# EAGLE design light_triggger_attiny44_(2) (EAGLE 6.4)
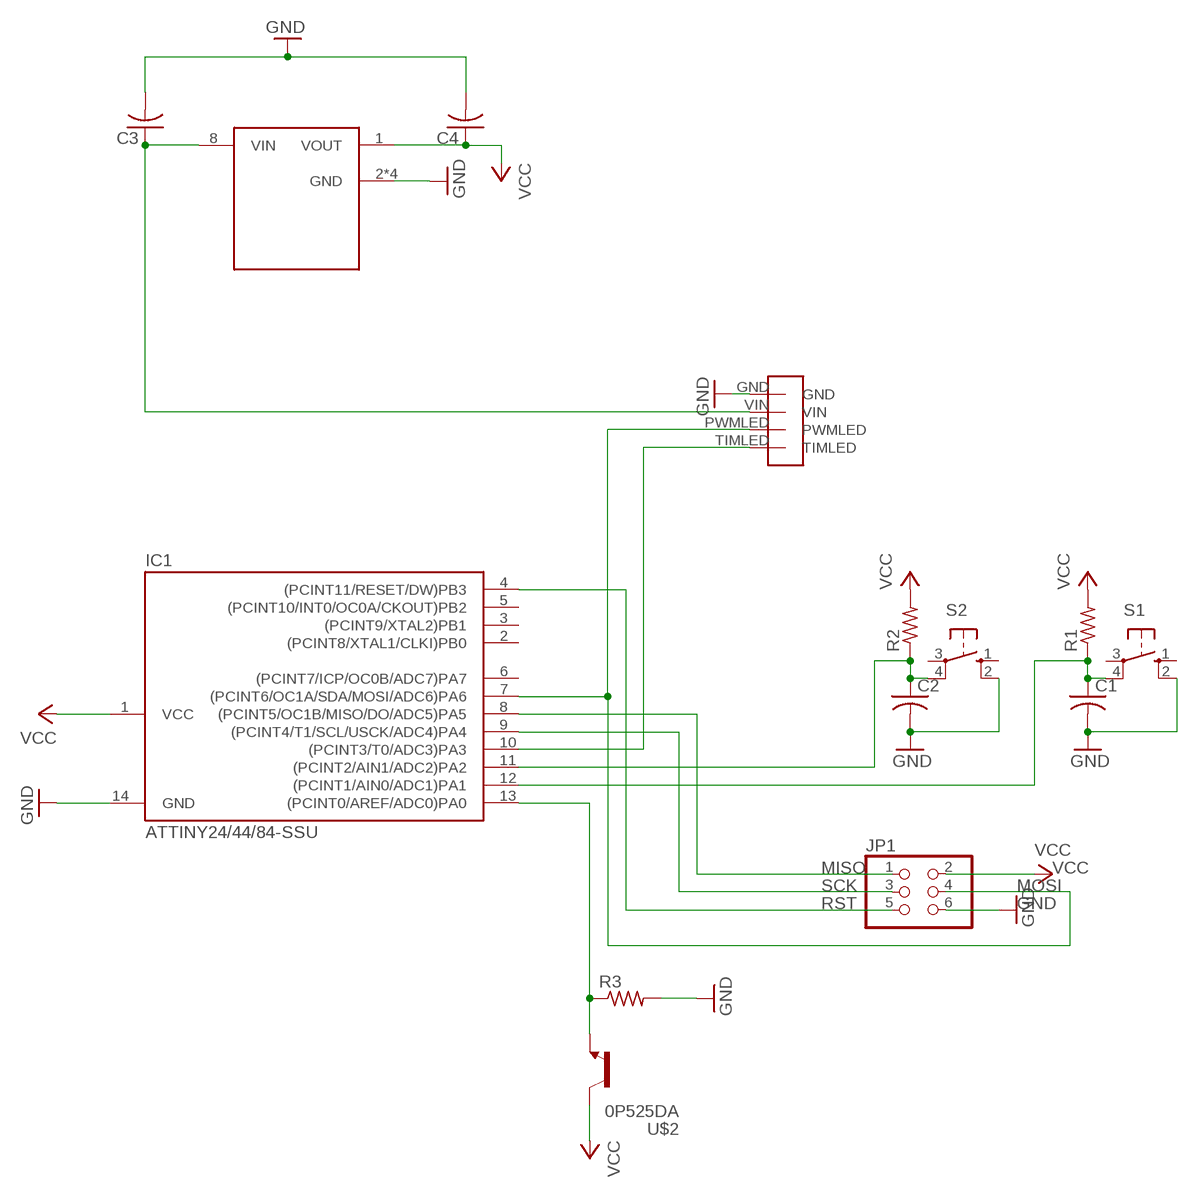
[diagram p0: schematic, sheet 1]

## Parts
C1  C-USC0603K  [C0603K]
C2  C-USC0603K  [C0603K]
C3  C-USC0603K  [C0603K]
C4  C-USC0603K  [C0603K]
IC1  ATTINY24/44/84-SSU  [SOIC14]
JP1  PINHD-2X3  [2X03]
R1  R-US_R0603  [R0603]
R2  R-US_R0603  [R0603]
R3  R-US_R0603  [R0603]
S1  10-XX  [B3F-10XX]
S2  10-XX  [B3F-10XX]
U$1  LM78L05  [LM78L05]
U$2  0P525DA  [PHOTOTRANSITOR(OP525DA)]
U$3  SM04B-GHS-TB  [SM04B-GHS-TB]

## Nets
GND: C1.2 C2.2 C3.2 C4.2 IC1.14(GND) JP1.6 R3.2 S1.2(S1) S2.2(S1) U$1.2(GND) U$1.3(GND) U$1.6(GND) U$1.7(GND) U$3.GND
MISO: IC1.8((PCINT5/OC1B/MISO/DO/ADC5)PA5) JP1.1
MOSI: IC1.7((PCINT6/OC1A/SDA/MOSI/ADC6)PA6) JP1.4 U$3.PWMLED
N$1: IC1.13((PCINT0/AREF/ADC0)PA0) R3.1 U$2.P$2(E)
N$2: IC1.10((PCINT3/T0/ADC3)PA3) U$3.TIMLED
N$3: C1.1 IC1.12((PCINT1/AIN0/ADC1)PA1) R1.1 S1.4(P1)
N$5: C2.1 IC1.11((PCINT2/AIN1/ADC2)PA2) R2.1 S2.4(P1)
RST: IC1.4((PCINT11/RESET/DW)PB3) JP1.5
SCK: IC1.9((PCINT4/T1/SCL/USCK/ADC4)PA4) JP1.3
VCC: C4.1 IC1.1(VCC) JP1.2 R1.2 R2.2 U$1.1(VOUT) U$2.P$1(C)
VIN: C3.1 U$1.8(VIN) U$3.VIN
Unconnected: IC1.2((PCINT8/XTAL1/CLKI)PB0) IC1.3((PCINT9/XTAL2)PB1) IC1.5((PCINT10/INT0/OC0A/CKOUT)PB2) IC1.6((PCINT7/ICP/OC0B/ADC7)PA7) S1.1(S) S1.3(P) S2.1(S) S2.3(P)

## Library data of the parts
C1-C4 = resistor:C-US: CAPACITOR, American symbol
IC1 = attiny24_44_84:ATTINY24/44/84
JP1 = pinhead:PINHD-2X3: PIN HEADER
R1-R3 = resistor:R-US_: RESISTOR, American symbol
S1 S2 = switch-omron:10-XX: OMRON SWITCH; MPN: B3F-1000; OC_FARNELL: 176432; OC_NEWARK: 36M3542
U$1 = LM78L05:LM78L05
U$2 = OPTEK:0P525DA
U$3 = Wire-to-Board:SM04B-GHS-TB

## Board
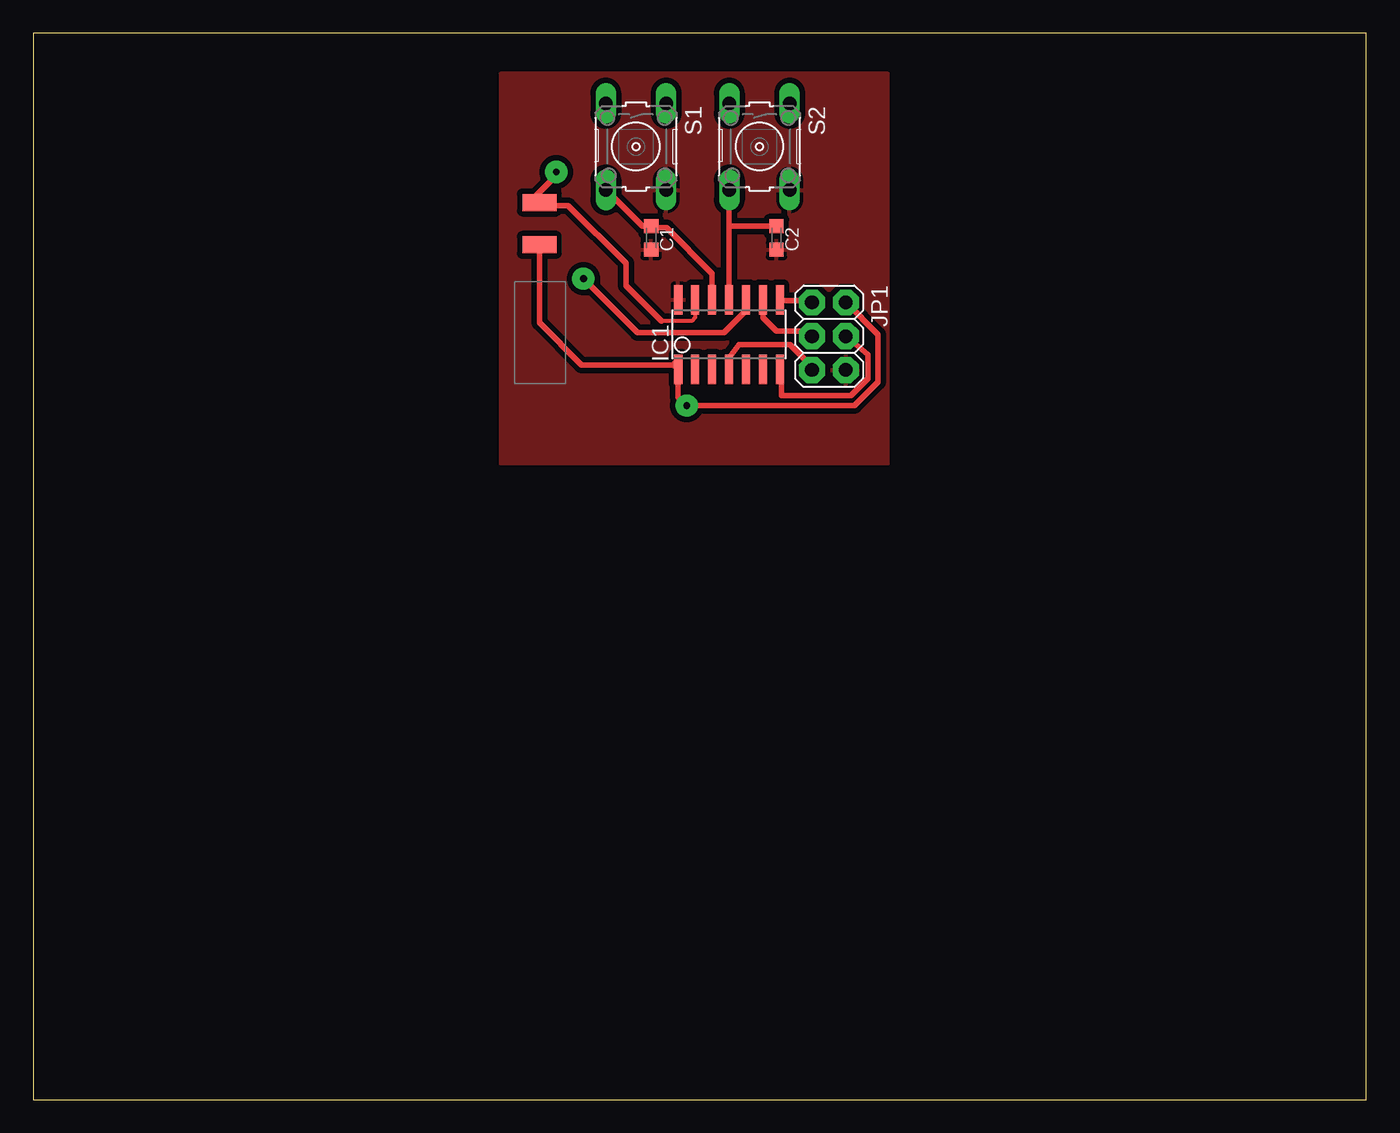
[diagram p1: board, top side]
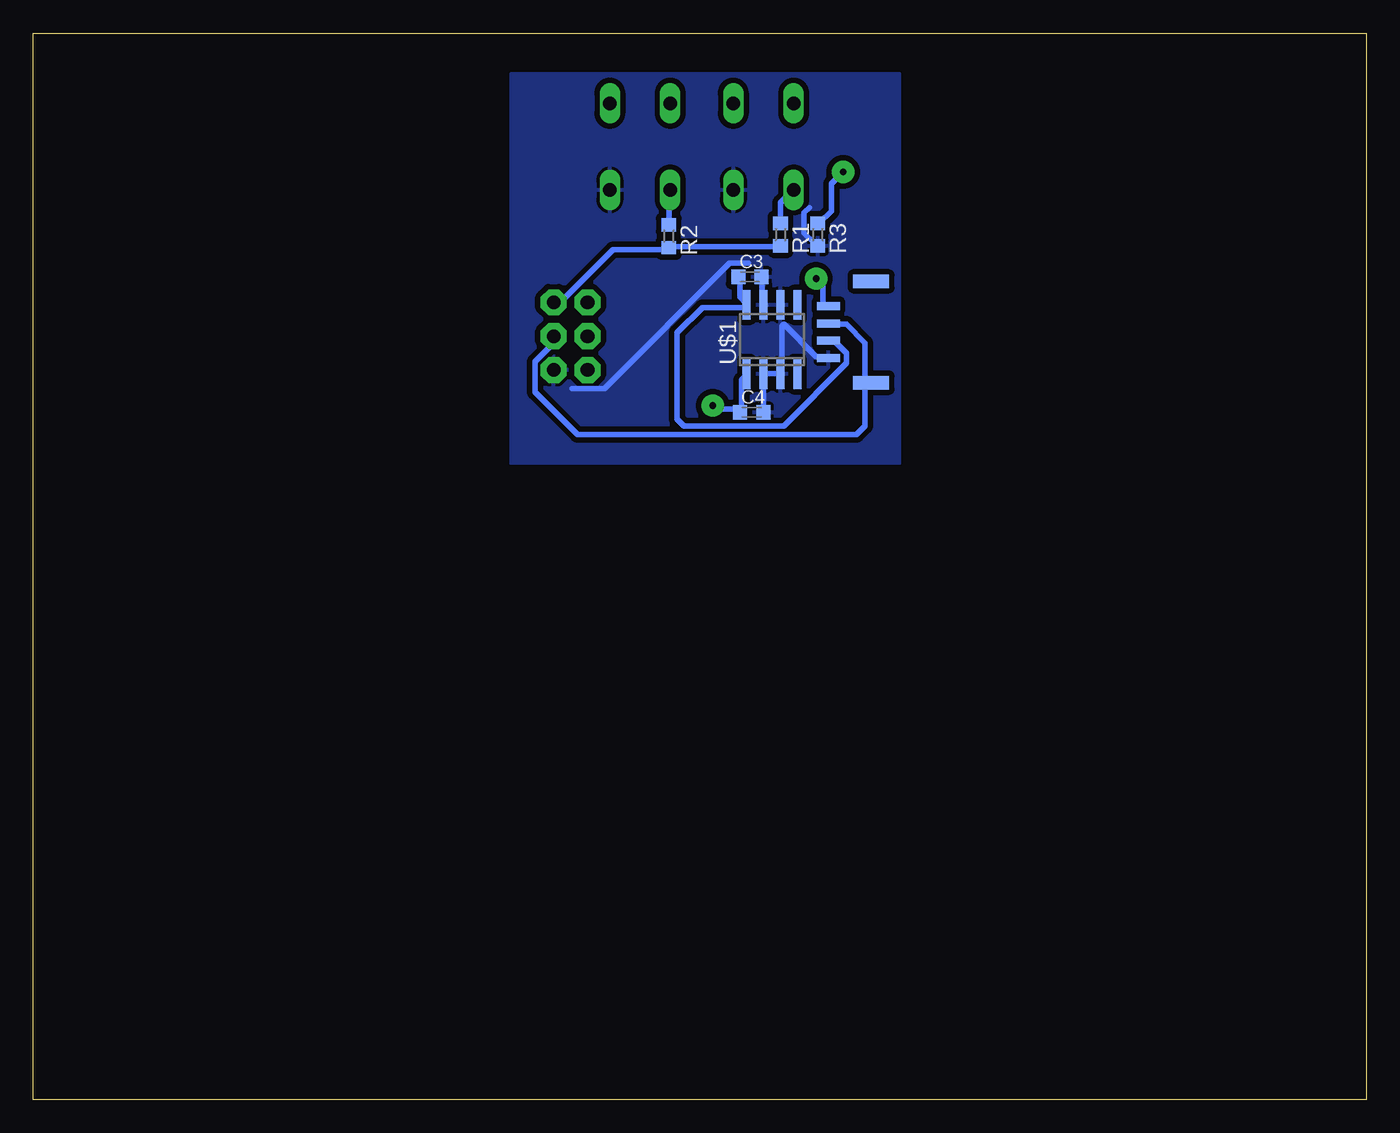
[diagram p2: board, bottom side, seen from below]

Size 100 x 80 mm. Coordinates in mm from the lower left corner, seen from the top.
Outline: 0,0 100,0 100,80 0,80 0,0
Copper layers (1*16): Top 0.035mm / dielectric 1.5mm / Bottom 0.035mm
Design rules "default *": minimum track width 16mil, minimum drill 24mil, track to track 8mil, track to pad 8mil, pad to pad 8mil, via to via 8mil, smd to smd 8mil, copper to edge 40mil, drill to drill 8mil, minimum pad ring 10mil, minimum via ring 8mil, stop-mask expansion 4mil, vias tented up to drill 0mil, thermal gap 10mil

### Footprints (pad centres in the part's own frame; a part is rotated, then mirrored left to right if it is on the bottom)
C0603K = smd 1.05 x 1.08: 1 -0.875,0; 2 0.875,0
SOIC14 = smd 0.61 x 2.21: 1 -3.81,-2.603; 2 -2.54,-2.603; 3 -1.27,-2.603; 4 0,-2.603; 5 1.27,-2.603; 6 2.54,-2.603; 7 3.81,-2.603; 8 3.81,2.603; 9 2.54,2.603; 10 1.27,2.603; 11 0,2.603; 12 -1.27,2.603; 13 -2.54,2.603; 14 -3.81,2.603
2X03 = drill 1.016 pad 1.93 octagon: 1 -2.54,-1.27; 2 -2.54,1.27; 3 0,-1.27; 4 0,1.27; 5 2.54,-1.27; 6 2.54,1.27
R0603 = smd 1 x 1.1: 1 -0.85,0; 2 0.85,0
B3F-10XX = drill 1.016 long: 1 -3.251,2.261; 2 3.251,2.261; 3 -3.251,-2.261; 4 3.251,-2.261
LM78L05 = smd 0.6 x 2.2: 1 -1.905,-2.6; 2 -0.635,-2.6; 3 0.635,-2.6; 4 1.905,-2.6; 5 1.905,2.6; 6 0.635,2.6; 7 -0.635,2.6; 8 -1.905,2.6
PHOTOTRANSITOR(OP525DA) = smd 2.54 x 1.27: P$1 -0.635,5.08; P$2 -0.635,1.905
SM04B-GHS-TB = smd 0.6 x 1.7: GND 2.42,4.66; PWMLED 5.02,4.66; TIMLED 6.32,4.66; VIN 3.72,4.66 | smd 1 x 2.7: P$2 0.57,1.46; P$4 8.17,1.46

### Placement (x,y rotation side)
C1  46.35,64.64 270 top
C2  55.75,64.64 270 top
C3  46.23,61.72 0 bottom
C4  46.1,51.56 0 bottom
IC1  52.2,57.4 0 top
JP1  59.69,57.28 270 top
R1  43.94,64.9 270 bottom
R2  52.32,64.77 270 bottom
R3  41.15,64.9 270 bottom
S1  45.21,71.5 270 top
S2  54.48,71.5 270 top
U$1  44.58,57.02 0 bottom
U$2  37.34,69.22 180 top
U$3  35.69,53.21 90 bottom

### Tracks (layer width: path | path; a pad name or v marks a point on that pad's centre or on a via)
GND
  Top 0.406: 55.75,63.75 C2.2
  Bottom 0.406: C4.2 45.21,51.56 U$1.2 45.09,54.48 43.94,54.48 U$1.3 43.81,54.61 43.81,58.04 43.69,58.17 41.27,55.75 40.39,55.75 U$3.GND | U$1.7 45.21,59.69 45.34,59.82 45.34,61.72 C3.2 45.47,61.85 | 41.15,64.01 R3.2 | 45.21,59.94 U$1.7 | 45.09,59.56 U$1.7 | 43.94,59.56 U$1.6 | 41.78,66.93 42.16,66.55 42.16,65.02 41.4,64.26 R3.2 | 41.27,64.14 R3.2 | 47.37,68.33 S1.2 | 59.56,53.34 57.15,53.34 47.75,62.74 46.35,62.74
  pour Bottom (isolate 0.406): 35.05,76.58 35.05,47.75 64.14,47.75 64.14,76.96 35.05,76.96
  pour Top (isolate 0.406): 35.05,76.58 35.05,47.75 64.14,47.75 64.14,76.96 35.05,76.96
MISO
  Top 0.406: JP1.1 58.29,59.94 56.01,59.94 IC1.8
MOSI
  Top 0.406: JP1.4 62.61,55.88 62.61,54.1 61.34,52.83 56.13,52.83 56.13,53.85 56.01,53.85 IC1.7 56.01,54.74
  Bottom 0.406: U$3.PWMLED 40.26,58.17 38.99,58.17 37.59,56.77 37.59,50.55 38.23,49.91 59.18,49.91 62.36,53.09 62.36,55.37 60.96,56.77 JP1.4
N$1  (via drill 0.5 pad 1.68)
  Top 0.305: IC1.13 49.66,58.67 49.4,58.42 47.12,58.42
  Top 0.406: 47.12,58.42 44.45,61.09 44.45,62.74 40.13,67.06 38.23,67.06 U$2.P$2 37.72,67.56 37.72,67.82 39.24,69.34 v39.24,69.6
  Bottom 0.406: R3.1 41.15,65.79 41.02,65.79 40.13,66.67 40.13,68.71 v39.24,69.6
N$2  (via drill 0.5 pad 1.68)
  Top 0.406: IC1.10 53.47,59.18 51.82,57.53 45.34,57.53 v41.27,61.59
  Bottom 0.406: 40.64,59.56 40.39,59.56 U$3.TIMLED 40.77,59.69 40.77,61.09 v41.27,61.59
N$3
  Top 0.406: IC1.12 50.93,61.98 47.5,65.41 46.48,65.41 C1.1 46.35,65.53 45.72,65.53 43.05,68.2 S1.4
  Bottom 0.406: R1.1 43.94,67.31 43.05,68.2 S1.4
N$5
  Top 0.406: 52.2,68.07 52.2,65.53 | 52.2,65.53 IC1.11 | 52.2,68.07 S2.4 52.32,68.2 52.2,68.2 52.2,68.07 | 52.2,65.53 55.75,65.53 C2.1
  Bottom 0.406: R2.1 52.32,68.2 S2.4
RST
  Top 0.406: IC1.4 52.2,55.63 52.96,56.64 56.77,56.64 58.17,55.24 58.17,54.99 JP1.5
SCK
  Top 0.406: IC1.9 54.74,58.67 55.75,57.66 58.04,57.66 JP1.3
VCC  (via drill 0.5 pad 1.68)
  Top 0.406: 48.39,54.86 IC1.1 | 48.26,54.99 IC1.1 | 48.01,55.12 48.26,55.37 48.26,55.5 48.39,55.63 | 48.01,55.12 48.07,55.12 IC1.1 | IC1.1 48.39,52.7 v49.02,52.07 61.59,52.07 63.37,53.85 63.37,57.4 JP1.2 | U$2.P$1 37.97,58.29 41.15,55.12 48.01,55.12
  Bottom 0.406: 52.2,64.01 R2.2 | R1.2 43.94,64.01 52.07,64.01 R2.2 | 46.86,53.47 46.86,53.98 46.48,54.36 U$1.1 46.48,53.85 46.86,53.47 | 46.86,51.94 46.86,51.56 C4.1 | 46.86,53.47 46.86,51.94 | 46.86,51.94 46.99,51.82 48.77,51.82 v49.02,52.07 | JP1.2 60.45,59.82 56.52,63.75 52.45,63.75 R2.2
VIN
  Bottom 0.406: C3.1 46.99,61.72 46.99,60.2 46.48,59.69 U$1.8 46.48,59.44 49.78,59.44 51.69,57.53 51.69,51.05 51.18,50.55 43.69,50.55 38.99,55.24 38.99,56.01 39.88,56.9 40.26,56.9 U$3.VIN